# EAGLE design RPI_SmartServo_th_v3 (EAGLE 6.4)
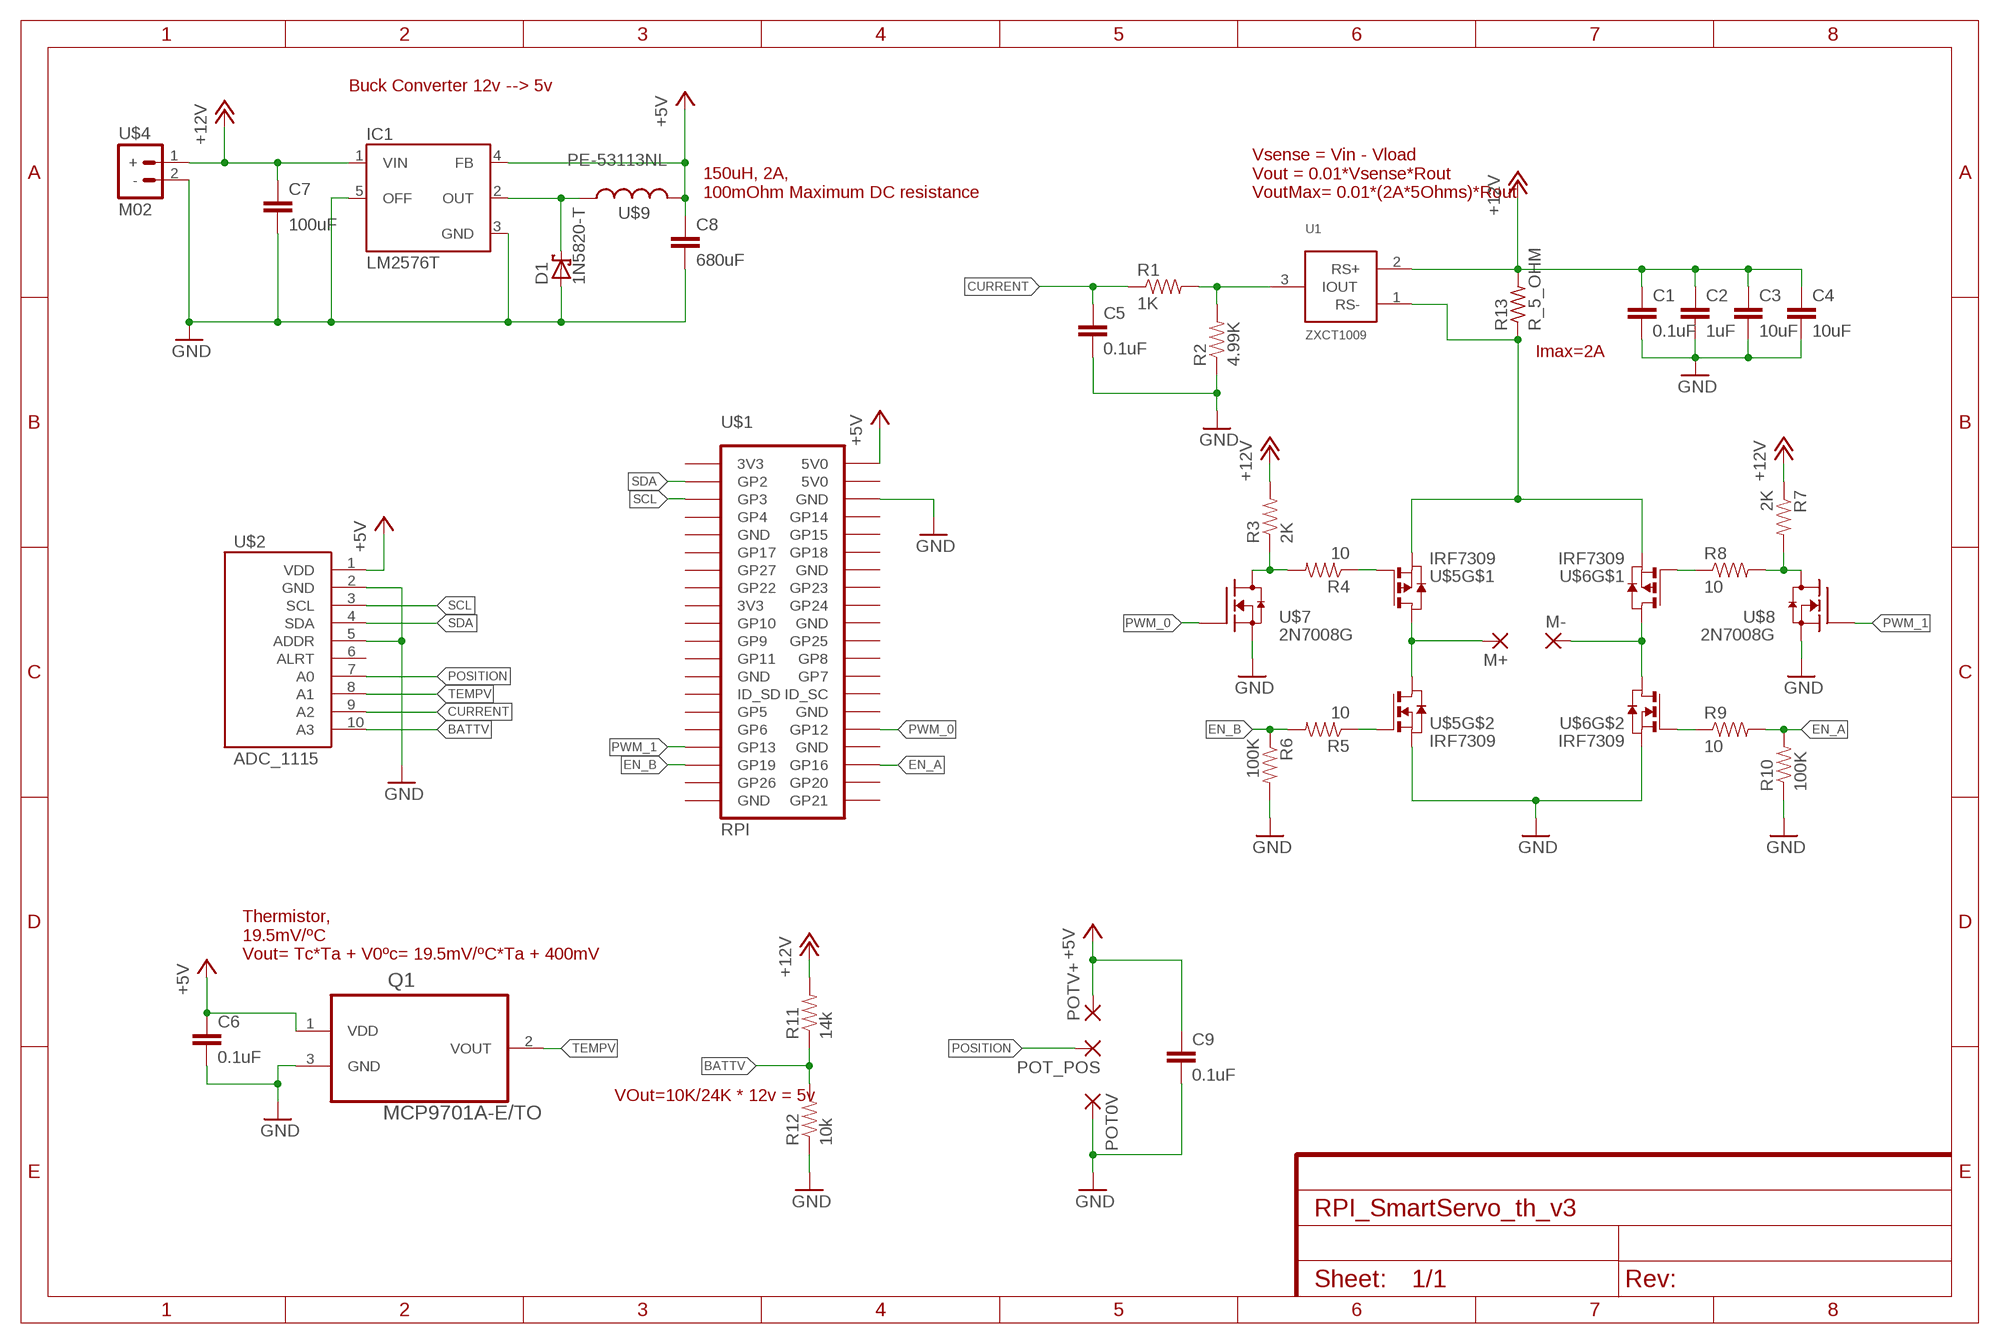
[diagram p0: schematic, sheet 1]

## Parts
C1  0.1uF  C-EU025-025X050  [C025-025X050]
C2  1uF  C-EU025-025X050  [C025-025X050]
C3  10uF  C-EU025-025X050  [C025-025X050]
C4  10uF  C-EU025-025X050  [C025-025X050]
C5  0.1uF  C-EU025-025X050  [C025-025X050]
C6  0.1uF  C-EU025-025X050  [C025-025X050]
C7  100uF  C-EU025-025X050  [C025-025X050]
C8  680uF  C-EU025-025X050  [C025-025X050]
C9  0.1uF  C-EU025-025X050  [C025-025X050]
D1  1N5820-T  SCHOTTKY-DIODEC4111-15  [C4111-15]
IC1  LM2576T  [TO220-5]
M+  1,6/0,9  [1,6/0,9]
M-  1,6/0,9  [1,6/0,9]
POT0V  1,6/0,9  [1,6/0,9]
POT_POS  1,6/0,9  [1,6/0,9]
POTV+  1,6/0,9  [1,6/0,9]
Q1  MCP9701A-E/TO  [TO127P254X533-3]
R1  1K  RESISTORPTH-1/4W  [AXIAL-0.4]
R2  4.99K  RESISTORPTH-1/4W  [AXIAL-0.4]
R3  2K  RESISTORPTH-1/4W  [AXIAL-0.4]
R4  10  RESISTORPTH-1/4W  [AXIAL-0.4]
R5  10  RESISTORPTH-1/4W  [AXIAL-0.4]
R6  100K  RESISTORPTH-1/4W  [AXIAL-0.4]
R7  2K  RESISTORPTH-1/4W  [AXIAL-0.4]
R8  10  RESISTORPTH-1/4W  [AXIAL-0.4]
R9  10  RESISTORPTH-1/4W  [AXIAL-0.4]
R10  100K  RESISTORPTH-1/4W  [AXIAL-0.4]
R11  14k  RESISTORPTH-1/4W  [AXIAL-0.4]
R12  10k  RESISTORPTH-1/4W  [AXIAL-0.4]
R13  R_5_OHM  [0922/22]
U1  ZXCT1009  [SOT23]
U$1  RPI  [2X20]
U$2  ADC_1115  [1X10]
U$4  M02  [1X02]
U$5  IRF7309  [SO8]
U$6  IRF7309  [SO8]
U$7  2N7008G  [TO-92]
U$8  2N7008G  [TO-92]
U$9  PE-53113NL  [KM-4]

## Nets
+5V: C6.1 C8.1 C9.1 IC1.4(FB) POTV+.1(P) Q1.1(VDD) U$1.2(5V0) U$2.1(VDD) U$9.P$2
+12V: C1.1 C2.1 C3.1 C4.1 C7.1 IC1.1(VIN) R3.P$2 R7.P$1 R11.P$2 R13.2 U1.2(RS+) U$4.1(+)
BATTV: R11.P$1 R12.P$2 U$2.10(A3)
CURRENT: C5.1 R1.P$1 U$2.9(A2)
EN_A: R9.P$2 R10.P$2 U$1.36(GP16)
EN_B: R5.P$2 R6.P$1 U$1.35(GP19)
GND: C1.2 C2.2 C3.2 C4.2 C5.2 C6.2 C7.2 C8.2 C9.2 D1.A IC1.3(GND) IC1.5(OFF) POT0V.1(P) Q1.3(GND) R2.P$1 R6.P$2 R10.P$1 R12.P$1 U$1.6(GND) U$2.2(GND) U$2.5(ADDR) U$4.2(-) U$5.1(S) U$6.1(S) U$7.1(S) U$8.1(S)
N$1: R1.P$2 R2.P$2 U1.3(IOUT)
N$4: M+.1(P) U$5.5(D) U$5.6(D) U$5.7(D) U$5.8(D)
N$5: R5.P$1 U$5.2(G)
N$6: R4.P$1 U$5.4(G)
N$7: M-.1(P) U$6.5(D) U$6.6(D) U$6.7(D) U$6.8(D)
N$8: R9.P$1 U$6.2(G)
N$9: R8.P$1 U$6.4(G)
N$10: D1.C IC1.2(OUT) U$9.P$1
N$12: R13.1 U1.1(RS-) U$5.3(S) U$6.3(S)
N$18: R3.P$1 R4.P$2 U$7.3(D)
N$21: R7.P$2 R8.P$2 U$8.3(D)
POSITION: POT_POS.1(P) U$2.7(A0)
PWM_0: U$1.32(GP12) U$7.2(G)
PWM_1: U$1.33(GP13) U$8.2(G)
SCL: U$1.5(GP3) U$2.3(SCL)
SDA: U$1.3(GP2) U$2.4(SDA)
TEMPV: Q1.2(VOUT) U$2.8(A1)
Unconnected: U$1.1(3V3) U$1.4(5V0) U$1.7(GP4) U$1.8(GP14) U$1.9(GND) U$1.10(GP15) U$1.11(GP17) U$1.12(GP18) U$1.13(GP27) U$1.14(GND) U$1.15(GP22) U$1.16(GP23) U$1.17(3V3) U$1.18(GP24) U$1.19(GP10) U$1.20(GND) U$1.21(GP9) U$1.22(GP25) U$1.23(GP11) U$1.24(GP8) U$1.25(GND) U$1.26(GP7) U$1.27(ID_SD) U$1.28(ID_SC) U$1.29(GP5) U$1.30(GND) U$1.31(GP6) U$1.34(GND) U$1.37(GP26) U$1.38(GP20) U$1.39(GND) U$1.40(GP21) U$2.6(ALRT)

## Notes on the sheet
- Buck Converter 12v --> 5v
- 150uH, 2A, 
  100mOhm Maximum DC resistance
- Vsense = Vin - Vload
  Vout = 0.01*Vsense*Rout
  VoutMax= 0.01*(2A*5Ohms)*Rout
- Imax=2A
- Thermistor,
  19.5mV/ºC
  Vout= Tc*Ta + V0ºc= 19.5mV/ºC*Ta + 400mV
- VOut=10K/24K * 12v = 5v

## Library data of the parts
C1-C9 = rcl:C-EU: CAPACITOR, European symbol
D1 = adafruit:SCHOTTKY-DIODE: Schottky Diode
IC1 = v-reg-3:LM2576: National Semiconductor <http://www.national.com> 3.0A "Simple Switcher"(c) 52kHz, Vout 1.23-37V (HV: 57V), Vin 40V (HV: 60V), 50µA standby current
M+ M- POT0V POT_POS POTV+ = wirepad:1,6/0,9: THROUGH-HOLE PAD
Q1 = 00LibreriaErle:MCP9701A-E/TO: THERMISTOR, LINEAR 19, 5MV/C; MPN: MCP9701A-E/TO; OC_FARNELL: 1439484; OC_NEWARK: 17M0680; PACKAGE: TO-92-3; SUPPLIER: Microchip
R1-R12 = SparkFun-Resistors:RESISTOR: Resistor Basic schematic elements and footprints for 0603, 1206, and PTH resistors.
R13 = 00LibreriaErle:R_5_OHM
U1 = 00LibreriaErle:ZXCT1009: ZXCT1009 Current Monitor (current output) http://www.diodes.com/zetex/_pdfs/3.0/pdf/ZXCT1009.pdf
U$1 = 00LibreriaErle:RPI: RPI pin header
U$2 = 00LibreriaErle:ADC_1115: ADC_1115 pin header for breakout board
U$4 = 00LibreriaErle:M02
U$5 U$6 = 00LibreriaErle:IRF7309: IRF7309 PN MOSFET
U$7 U$8 = 00LibreriaErle:2N7008G: 2N7008-G-ND THROUGH HOLE DEVICE
U$9 = 00LibreriaErle:PE-53113NL

## Board
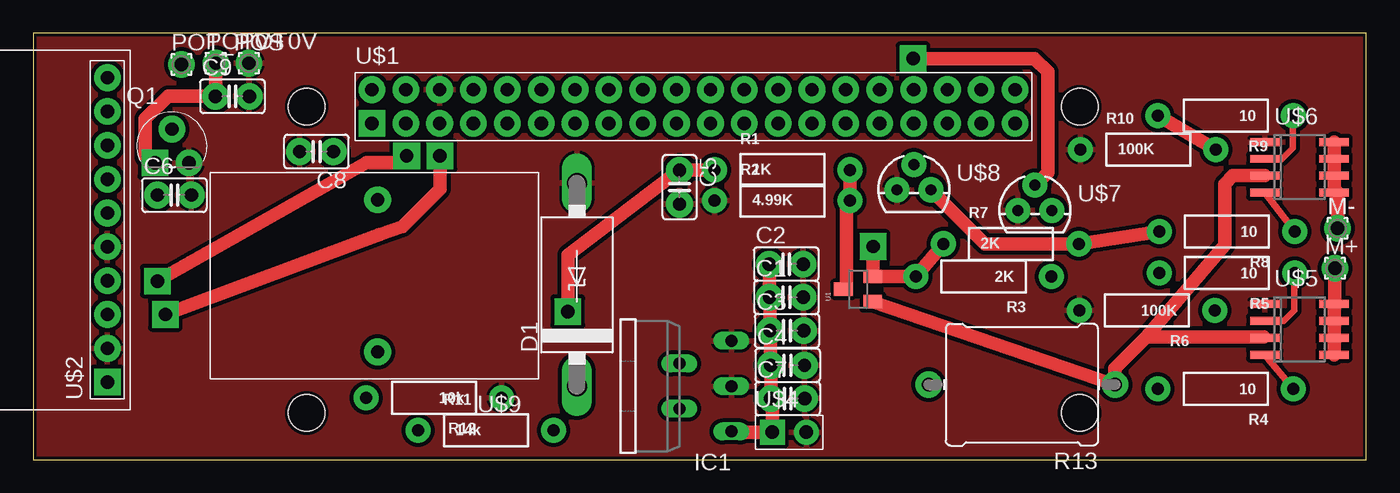
[diagram p1: board, top side]
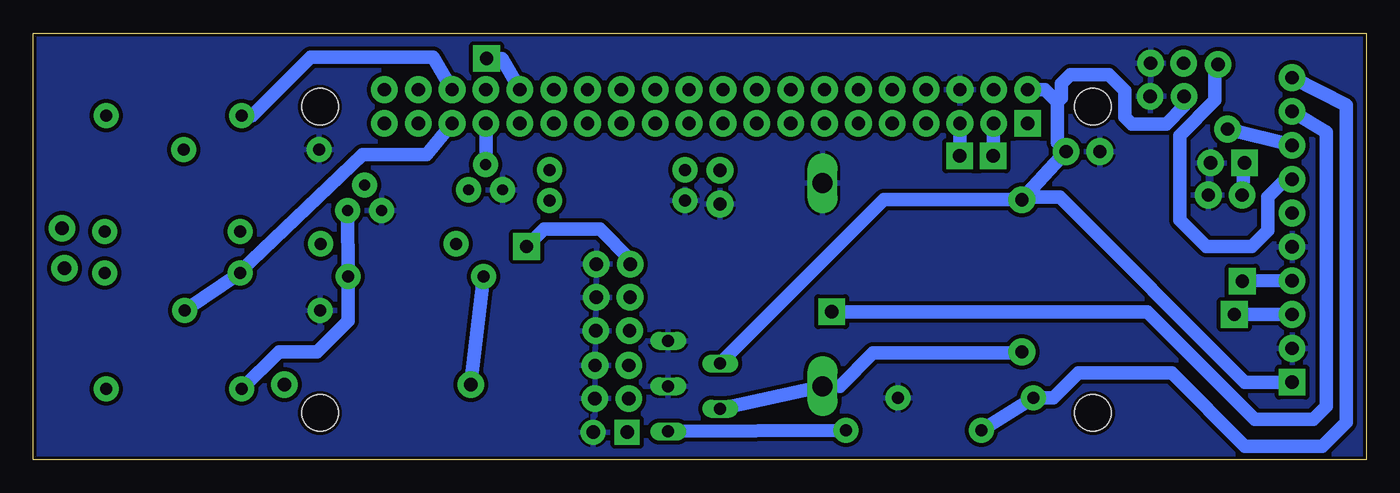
[diagram p2: board, bottom side, seen from below]

Size 100 x 32 mm. Coordinates in mm from the lower left corner, seen from the top.
Outline: 0,0 100,0 100,32 0,32 0,0
Copper layers (1*16): Top 0.035mm / dielectric 1.55mm / Bottom 0.035mm
Design rules "PCB_gprs": minimum track width 0.15mm, minimum drill 0.35mm, track to track 0.3mm, track to pad 0.3mm, pad to pad 0.3mm, via to via 0.3mm, smd to smd 0mil, copper to edge 0.25mm, drill to drill 0.35mm, minimum pad ring 0.175mm, minimum via ring 0.125mm, stop-mask expansion 0mil, vias tented up to drill 0.45mm, thermal gap 0.2mm
Holes 2.75 mm at 20.5,26.5 20.5,3.5 78.5,3.5 78.5,26.5

### Footprints (pad centres in the part's own frame; a part is rotated, then mirrored left to right if it is on the bottom)
C025-025X050 = drill 1 pad 2: 1 -1.27,0; 2 1.27,0
C4111-15 = drill 1.499 long: A 7.62,0; C -7.62,0
TO220-5 = drill 0.9 long: 1 -3.4,-8.4; 2 -1.7,-4.5; 3 0,-8.4; 4 1.7,-4.5; 5 3.4,-8.4
1,6/0,9 = drill 1 pad 2: 1 0,0
TO127P254X533-3 = drill 1 pad 2 square: 1 -2.54,-2.54 | drill 1 pad 2: 2 -1.27,0; 3 0,-2.54
AXIAL-0.4 = drill 0.9 pad 1.88: P$1 -5.08,0; P$2 5.08,0
0922/22 = drill 1 pad 2: 1 -7.62,0; 2 6.35,0
SOT23 = smd 1 x 1.4: 1 -0.95,-1.1; 2 0.95,-1.1; 3 0,1.1
2X20 = drill 1 pad 2 square: 1 -24.13,-1.27 | drill 1 pad 2: 2 -24.13,1.27; 3 -21.59,-1.27; 4 -21.59,1.27; 5 -19.05,-1.27; 6 -19.05,1.27; 7 -16.51,-1.27; 8 -16.51,1.27; 9 -13.97,-1.27; 10 -13.97,1.27; 11 -11.43,-1.27; 12 -11.43,1.27; 13 -8.89,-1.27; 14 -8.89,1.27; 15 -6.35,-1.27; 16 -6.35,1.27; 17 -3.81,-1.27; 18 -3.81,1.27; 19 -1.27,-1.27; 20 -1.27,1.27; 21 1.27,-1.27; 22 1.27,1.27; 23 3.81,-1.27; 24 3.81,1.27; 25 6.35,-1.27; 26 6.35,1.27; 27 8.89,-1.27; 28 8.89,1.27; 29 11.43,-1.27; 30 11.43,1.27; 31 13.97,-1.27; 32 13.97,1.27; 33 16.51,-1.27; 34 16.51,1.27; 35 19.05,-1.27; 36 19.05,1.27; 37 21.59,-1.27; 38 21.59,1.27; 39 24.13,-1.27; 40 24.13,1.27
1X10 = drill 1 pad 2 square: 1 -10.922,-3.302 | drill 1 pad 2: 2 -8.382,-3.302; 3 -5.842,-3.302; 4 -3.302,-3.302; 5 -0.762,-3.302; 6 1.778,-3.302; 7 4.318,-3.302; 8 6.858,-3.302; 9 9.398,-3.302; 10 11.938,-3.302
1X02 = drill 1.016 pad 1.88 square: 1 0,0 | drill 1.016 pad 1.88: 2 2.54,0
SO8 = smd 0.6 x 2.2: 1 -1.905,-2.6; 2 -0.635,-2.6; 3 0.635,-2.6; 4 1.905,-2.6; 5 1.905,2.6; 6 0.635,2.6; 7 -0.635,2.6; 8 -1.905,2.6
TO-92 = drill 0.813 pad 1.88: 1 -1.27,0; 2 0,1.905; 3 1.27,0
KM-4 = drill 1 pad 2: P$1 12.065,-2.032; P$2 12.065,-13.462

### Placement (x,y rotation side)
C1  56.5,12.18 0 top
C2  56.49,14.67 0 top
C3  56.54,9.67 0 top
C4  56.59,7.07 0 top
C5  48.48,20.45 270 top
C6  10.58,19.86 0 top
C7  56.6,4.58 0 top
C8  21.25,23.12 180 top
C9  14.94,27.27 0 top
D1  40.78,13.12 90 top
IC1  43.97,5.51 90 top
M+  97.66,14.36 0 top
M-  97.85,17.36 0 top
POT0V  16.17,29.76 0 top
POT_POS  11.11,29.66 0 top
POTV+  13.69,29.76 0 top
Q1  11.67,24.81 0 top
R1  56.2,21.75 0 top
R2  56.2,19.45 0 top
R3  71.3,13.75 180 top
R4  89.45,5.3 180 top
R5  89.55,14 180 top
R6  83.55,11.2 180 top
R7  73.35,16.2 0 top
R8  89.55,17.12 180 top
R9  89.45,25.82 180 top
R10  83.65,23.28 0 top
R11  33.95,2.18 0 top
R12  30.05,4.64 180 top
R13  73.53,5.62 180 top
U1  61.88,12.79 90 top
U$1  49.53,26.5 0 top
U$2  2.25,16.73 90 top
U$4  55.45,2.05 0 top
U$5  94.99,9.78 270 top
U$6  94.99,21.94 270 top
U$7  75.15,18.7 0 top
U$8  66.07,20.25 0 top
U$9  37.9,6.05 180 top

### Tracks (layer width: path | path; a pad name or v marks a point on that pad's centre or on a via)
+5V
  Top 0.5: 13.67,29.74 POTV+.1 | Q1.1 9.13,21.97 | 13.64,27.3 C9.1
  Top 1: C9.1 13.67,29.74 | 9.13,21.97 8.4,22.7 8.4,25.6 10.1,27.3 13.64,27.3
  Bottom 0.5: 25.65,19.7 U$9.P$2
  Bottom 1: Q1.1 C6.1 | IC1.4 36.17,19.51 U$9.P$2 C8.1 23.18,23.78 23.18,26.83 | C9.1 13.67,26.53 15,25.2 17.6,25.2 18.1,25.7 18.1,27.7 19.3,28.9 22.18,28.9 22.87,28.21 22.87,27.14 23.18,26.83 | U$2.1 9.11,5.81 23,19.7 25.65,19.7 | 23.18,26.83 24.12,27.77 U$1.2
+12V  (via drill 1 pad 2)
  Top 0.406: 52.43,2.05 IC1.1 | 55.45,4.46 C7.1 | C4.1 | 55.32,9.62 C3.1 | 55.27,12.14 C1.1 | C2.1
  Top 0.5: U1.2 63,13.76
  Top 1: 52.43,2.05 U$4.1 55.45,4.46 | C7.1 C4.1 | C4.1 55.32,9.62 | C3.1 55.27,12.14 | C1.1 C2.1 | U1.2 R3.P$2 R7.P$1 | 63,13.76 v63,16
  Bottom 0.5: 55.22,15.02 C2.1
  Bottom 1: R3.P$2 R13.2 | IC1.1 R11.P$2 | v63,16 61.7,17.3 57.5,17.3 55.22,15.02
BATTV
  Bottom 1: R11.P$1 R12.P$2 23.46,4.64 21.6,6.5 14.6,6.5 9.1,1 3.3,1 1.5,2.8 1.5,26.62 U$2.10
CURRENT  (via drill 1 pad 2)
  Top 1: R1.P$1 C5.1 40.1,15.34 v40.1,11.1
  Bottom 0.5: U$2.9 5.53,26.13
  Bottom 1: 5.53,26.13 3,24.6 3,4 3.97,3.03 8.34,3.03 16.41,11.1 v40.1,11.1
EN_A
  Top 1: R10.P$2 R9.P$2
  Bottom 0.5: R9.P$2 83.58,25.82
  Bottom 1: 83.58,25.82 79.2,30.2 70.01,30.2 U$1.36
EN_B
  Bottom 0.5: R5.P$2 84.47,14.13
  Bottom 1: R5.P$2 R6.P$1 | 84.47,14.13 75.3,22.91 70.51,22.91 U$1.35
GND
  pour Bottom: 0,32 100,32 100,0 0,0
  pour Top: 0,32 100,32 100,0 0,0
N$1
  Top 1: R1.P$2 R2.P$2 61.28,19.28 61,19 61,13.01 U1.3
N$4
  Top 0.5: U$5.8 97.66,11.69
  Top 1: U$5.5 U$5.6 U$5.7 U$5.8 | 97.66,11.69 M+.1
N$5
  Top 0.406: 94.6,13.97 R5.P$1
  Top 0.5: U$5.2 93.81,10.41 94.6,11.2 94.6,13.97
N$6
  Top 0.5: U$5.4 R4.P$1
N$7
  Top 1: U$6.8 U$6.7 U$6.6 U$6.5 97.85,20.04 M-.1
N$8
  Top 0.406: 94.5,25.79 R9.P$1
  Top 0.5: U$6.2 93.67,22.57 94.5,23.4 94.5,25.79
N$9
  Top 0.5: R8.P$1 U$6.4
N$10
  Bottom 0.5: D1.C 39.5,5.5 | 25.92,8 U$9.P$1
  Bottom 1: IC1.2 D1.C | 39.5,5.5 37,8 25.92,8
N$12
  Top 0.406: 92.33,9.2 U$5.3
  Top 1: U1.1 R13.1 81.15,6.85 83.5,9.2 | 83.5,9.2 92.33,9.2 | U$6.3 90,21.3 89.4,20.7 89.4,16.1 83.5,9.2
N$18
  Bottom 1: U$7.3 R3.P$1 76.38,10.42 78.7,8.1 81.57,8.1 R4.P$2
N$21
  Top 1: R8.P$2 R7.P$2 71.39,16.2 U$8.3
POSITION
  Bottom 1: U$2.7 6.03,21.05 7.39,19.69 7.39,17.21 8.6,16 12,16 14,18 14,24.32 11.35,26.97 11.35,29.42 POT_POS.1
PWM_0  (via drill 1 pad 2)
  Top 1: U$7.2 76.1,21.55 76.1,29.1 75.1,30.1 v66,30.1
  Bottom 1: v66,30.1 64.83,30.1 U$1.32
PWM_1
  Bottom 0.5: U$8.2 66.04,22.16
  Bottom 1: 66.04,22.16 U$1.33
SCL  (via drill 1 pad 2)
  Top 1: v30.5,22.8 30.5,20.3 27.7,17.5 25.97,16.89 v9.9,10.9
  Bottom 1: U$2.3 v9.9,10.9 | v30.5,22.8 U$1.5
SDA  (via drill 1 pad 2)
  Top 0.5: 27.8,22.8 v28,22.8
  Top 1: 27.8,22.8 27.3,22.3 25.02,22.3 v9.3,13.4
  Bottom 1: U$2.4 v9.3,13.4 | v28,22.8 U$1.3
TEMPV
  Bottom 1: Q1.2 U$2.8